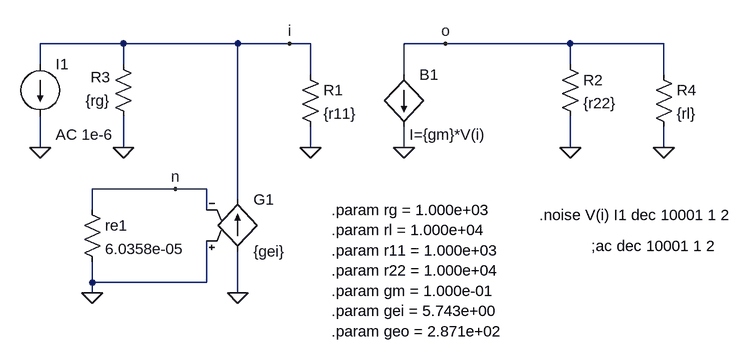
[diagram p0: schematic unsimpleNF.asc]
unsimpleNF.asc, the LTspice schematic file:
Version 4
SHEET 1 880 680
WIRE -864 -544 -992 -544
WIRE -688 -544 -864 -544
WIRE -608 -544 -688 -544
WIRE -576 -544 -608 -544
WIRE -368 -544 -432 -544
WIRE -176 -544 -368 -544
WIRE -32 -544 -176 -544
WIRE -992 -512 -992 -544
WIRE -864 -512 -864 -544
WIRE -176 -512 -176 -544
WIRE -576 -496 -576 -544
WIRE -432 -496 -432 -544
WIRE -32 -496 -32 -544
WIRE -992 -384 -992 -432
WIRE -864 -384 -864 -432
WIRE -576 -384 -576 -416
WIRE -432 -384 -432 -416
WIRE -176 -384 -176 -432
WIRE -32 -384 -32 -416
WIRE -784 -320 -912 -320
WIRE -736 -320 -784 -320
WIRE -688 -304 -688 -544
WIRE -912 -288 -912 -320
WIRE -736 -288 -736 -320
WIRE -912 -176 -912 -208
WIRE -736 -176 -736 -240
WIRE -736 -176 -912 -176
WIRE -912 -160 -912 -176
WIRE -688 -160 -688 -224
FLAG -992 -384 0
FLAG -432 -384 0
FLAG -576 -384 0
FLAG -176 -384 0
FLAG -368 -544 o
FLAG -608 -544 i
FLAG -864 -384 0
FLAG -688 -160 0
FLAG -912 -160 0
FLAG -32 -384 0
FLAG -784 -320 n
SYMBOL res -592 -512 R0
SYMATTR InstName R1
SYMATTR Value {r11}
SYMBOL bi -432 -496 R0
WINDOW 3 8 92 Left 2
SYMATTR InstName B1
SYMATTR Value I={gm}*V(i)
SYMBOL res -192 -528 R0
SYMATTR InstName R2
SYMATTR Value {r22}
SYMBOL res -848 -416 R180
WINDOW 0 36 76 Left 2
WINDOW 3 36 40 Left 2
SYMATTR InstName R3
SYMATTR Value {rg}
SYMBOL current -992 -512 R0
WINDOW 123 24 108 Left 2
WINDOW 39 0 0 Left 2
SYMATTR Value2 AC 1e-6
SYMATTR InstName I1
SYMATTR Value ""
SYMBOL g2 -688 -320 R0
SYMATTR InstName G1
SYMATTR Value {gei}
SYMBOL res -928 -304 R0
SYMATTR InstName re1
SYMATTR Value 6.0358e-05
SYMBOL res -48 -512 R0
SYMATTR InstName R4
SYMATTR Value {rl}
TEXT -224 -280 Left 2 !.noise V(i) I1 dec 10001 1 2
TEXT -144 -232 Left 2 !;ac dec 10001 1 2
TEXT -544 -288 Left 2 !.param rg = 1.000e+03\n.param rl = 1.000e+04\n.param r11 = 1.000e+03\n.param r22 = 1.000e+04\n.param gm = 1.000e-01\n.param gei = 5.743e+00\n.param geo = 2.871e+02

The netlist it stands for:
* unsimpleNF.asc
R1 i 0 {r11}
B1 o 0 I={gm}*V(i)
R2 o 0 {r22}
R3 0 i {rg}
I1 i 0 AC 1e-6
G1 0 i 0 n {gei}
re1 n 0 6.0358e-05
R4 o 0 {rl}
.noise V(i) I1 dec 10001 1 2
;ac dec 10001 1 2
.param rg = 1.000e+03
.param rl = 1.000e+04
.param r11 = 1.000e+03
.param r22 = 1.000e+04
.param gm = 1.000e-01
.param gei = 5.743e+00
.param geo = 2.871e+02
.backanno
.end